# Altium schematic sheet DRIVER_LED&AFE.SchDoc
size B
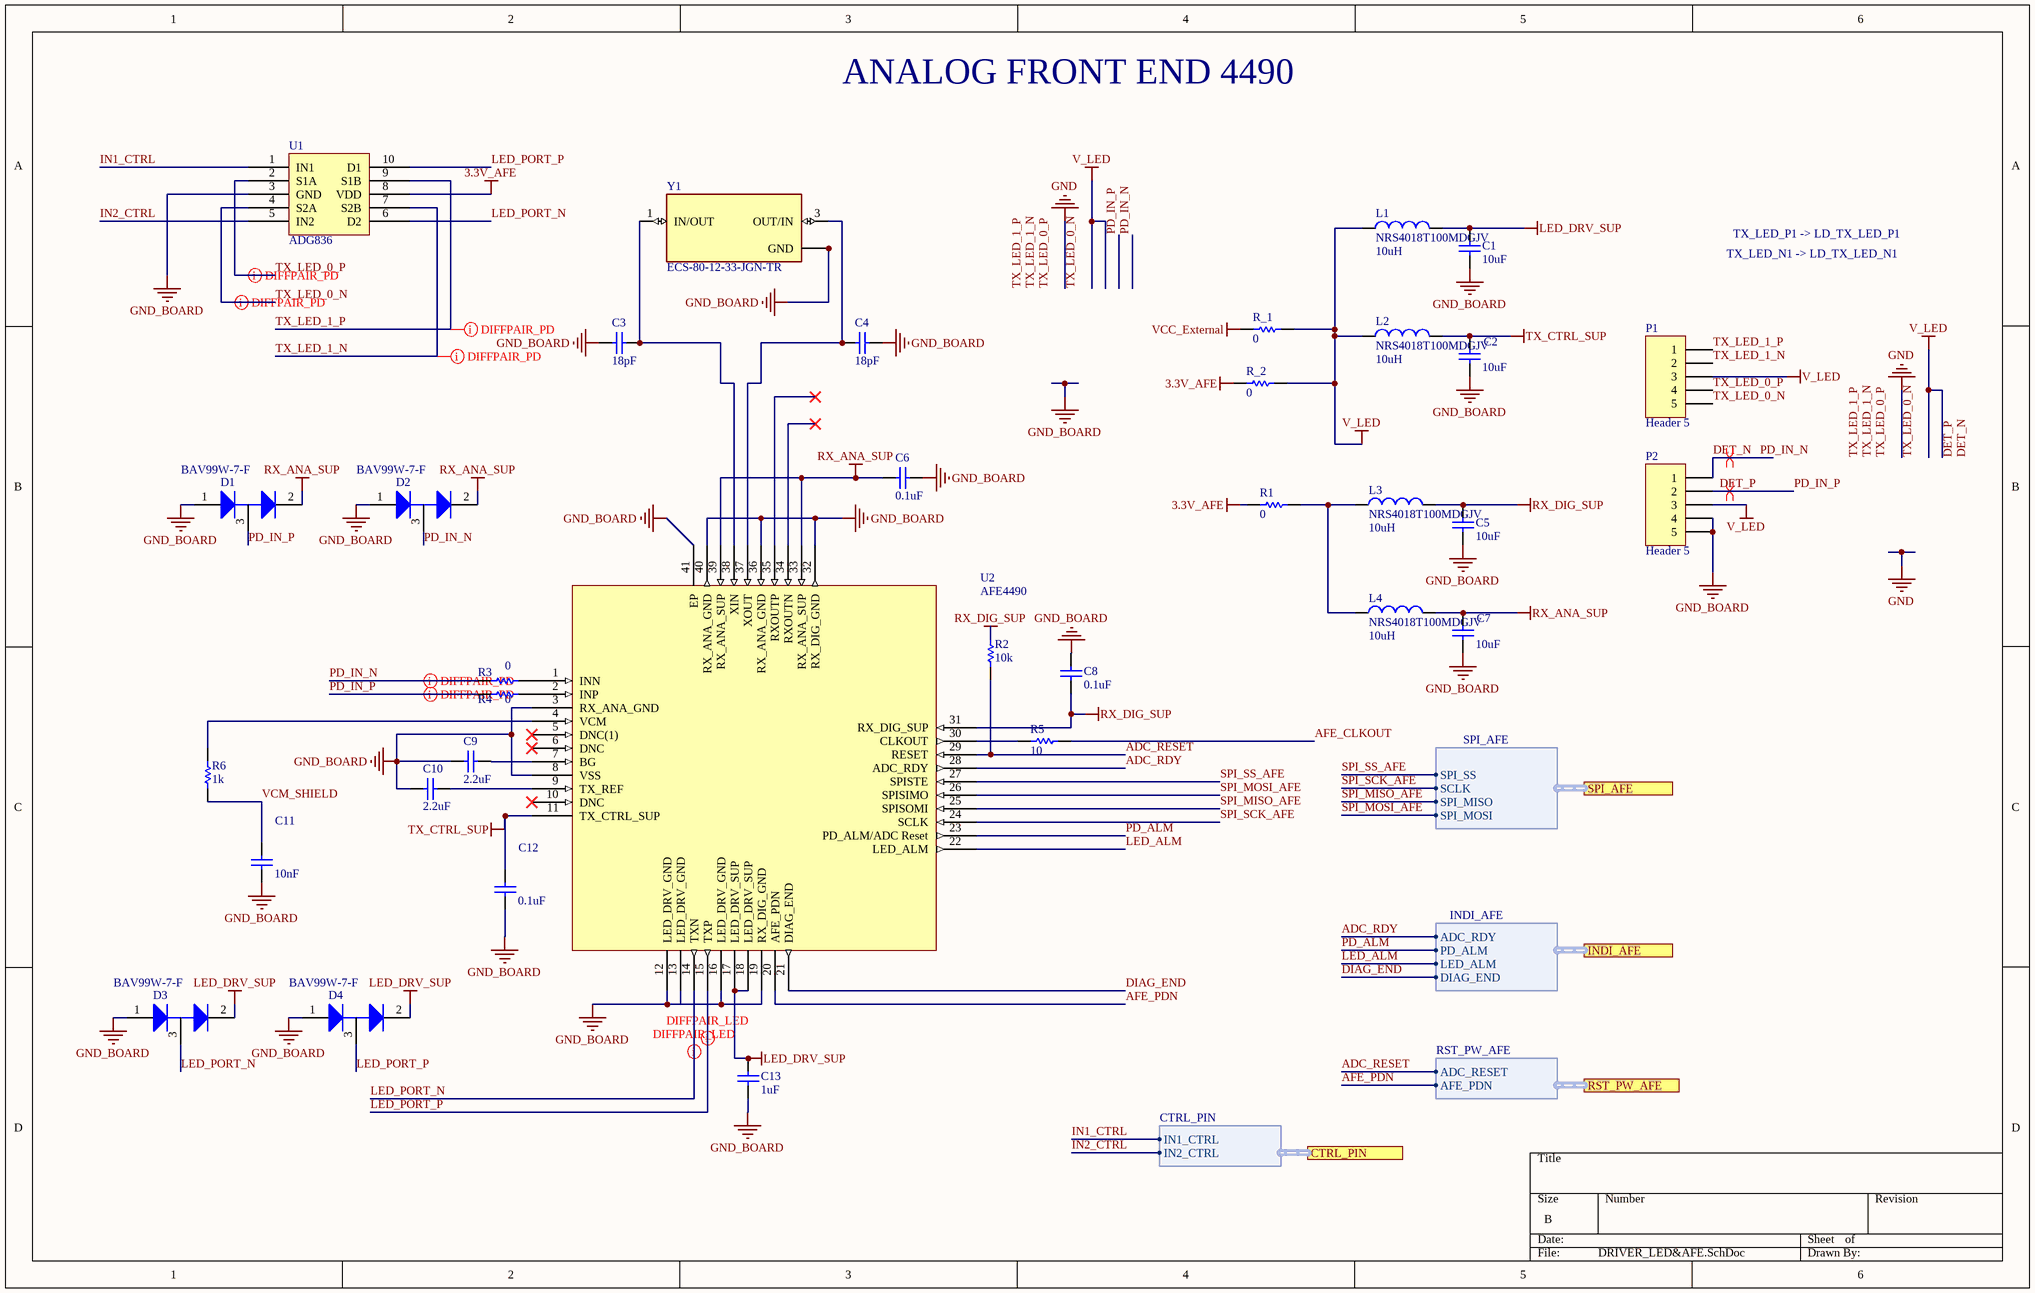
[diagram p0: DRIVER_LED&AFE.SchDoc]

## Parts
C1  value 10uF  [RES-SMD-0603]  (hidden comment: Cap)
C2  value 10uF  [RES-SMD-0603]  (hidden comment: Cap)
C3  value 18pF  [RES-SMD-0603]  (hidden comment: Cap)
C4  value 18pF  [RES-SMD-0603]  (hidden comment: Cap)
C5  value 10uF  [RES-SMD-0603]  (hidden comment: Cap)
C6  value 0.1uF  [RES-SMD-0603]  (hidden comment: Cap)
C7  value 10uF  [RES-SMD-0603]  (hidden comment: Cap)
C8  value 0.1uF  [RES-SMD-0603]  (hidden comment: Cap)
C9  value 2.2uF  [RES-SMD-0603]  (hidden comment: Cap)
C10  value 2.2uF  [RES-SMD-0603]  (hidden comment: Cap)
C11  value 10nF  [RES-SMD-0603]  (hidden comment: Cap)
C12  value 0.1uF  [RES-SMD-0603]  (hidden comment: Cap)
C13  value 1uF  [RES-SMD-0603]  (hidden comment: Cap)
D1  BAV99W-7-F  [SOT-323]
D2  BAV99W-7-F  [SOT-323]
D3  BAV99W-7-F  [SOT-323]
D4  BAV99W-7-F  [SOT-323]
L1  NRS4018T100MDGJV  value 10uH  [NRS4018]
L2  NRS4018T100MDGJV  value 10uH  [NRS4018]
L3  NRS4018T100MDGJV  value 10uH  [NRS4018]
L4  NRS4018T100MDGJV  value 10uH  [NRS4018]
P1  Header 5  [HDR1X5]
P2  Header 5  [HDR1X5]
R1  value 0  [RES-SMD-0603]  (hidden comment: Res1)
R2  value 10k  [RES-SMD-0603]  (hidden comment: Res1)
R3  value 0  [RES-SMD-0603]  (hidden comment: Res1)
R4  value 0  [RES-SMD-0603]  (hidden comment: Res1)
R5  value 10  [RES-SMD-0603]  (hidden comment: Res1)
R6  value 1k  [RES-SMD-0603]  (hidden comment: Res1)
R_1  value 0  [RES-SMD-0603]  (hidden comment: Res1)
R_2  value 0  [RES-SMD-0603]  (hidden comment: Res1)
U1  ADG836  [MSOP-10]
U2  AFE4490  [VQFN (40)]
Y1  ECS-80-12-33-JGN-TR  [XTAL_ECS-240-8-33-AGN-TR]

## Ports
CTRL_PIN (harness CTRL_PIN), INDI_AFE (harness INDI_AFE), RST_PW_AFE (harness RST_PW_AFE), SPI_AFE (harness SPI_AFE)

## Harnesses
SPI_AFE: SPI_SS, SCLK, SPI_MISO, SPI_MOSI
INDI_AFE: ADC_RDY, PD_ALM, LED_ALM, DIAG_END
RST_PW_AFE: ADC_RESET, AFE_PDN
CTRL_PIN: IN1_CTRL, IN2_CTRL

## Nets
3.3V_AFE: R1.1 R_2.1 U1.8(VDD)
GND_BOARD: C1.2 C2.1 C3.1 C4.2 C5.2 C6.2 C7.1 C8.1 C9.2 C10.2 C11.1 C12.1 C13.1 D1.1 D2.1 D3.1 D4.1 P2.4 P2.5 U1.3(GND) U2.3(RX_ANA_GND) U2.8(VSS) U2.12(LED_DRV_GND) U2.13(LED_DRV_GND) U2.16(LED_DRV_GND) U2.19(RX_DIG_GND) U2.32(RX_DIG_GND) U2.36(RX_ANA_GND) U2.40(RX_ANA_GND) U2.41(EP) Y1.2(GND) Y1.4(GND)
LED_DRV_SUP: C1.1 C13.2 D3.2 D4.2 L1.2 U2.17(LED_DRV_SUP) U2.18(LED_DRV_SUP)
RX_ANA_SUP: C6.1 C7.2 D1.2 D2.2 L4.2 U2.33(RX_ANA_SUP) U2.39(RX_ANA_SUP)
RX_DIG_SUP: C5.1 C8.2 L3.2 R2.1 U2.31(RX_DIG_SUP)
TX_CTRL_SUP: C2.2 C12.2 L2.2 U2.11(TX_CTRL_SUP)
V_LED: L1.1 L2.1 P1.3 P2.3 R_1.2 R_2.2
VCC_External: R_1.1
ADC_RDY: U2.28(ADC_RDY) ; port INDI_AFE.ADC_RDY
ADC_RESET: R2.2 U2.29(RESET) ; port RST_PW_AFE.ADC_RESET
AFE_CLKOUT: R5.1
AFE_PDN: U2.20(AFE_PDN) ; port RST_PW_AFE.AFE_PDN
DET_N: D2.3 P2.1 R3.1  [also labelled PD_IN_N]
DET_P: D1.3 P2.2 R4.1  [also labelled PD_IN_P]
DIAG_END: U2.21(DIAG_END) ; port INDI_AFE.DIAG_END
IN1_CTRL: U1.1(IN1) ; port CTRL_PIN.IN1_CTRL
IN2_CTRL: U1.5(IN2) ; port CTRL_PIN.IN2_CTRL
LED_ALM: U2.22(LED_ALM) ; port INDI_AFE.LED_ALM
LED_PORT_N: D3.3 U1.6(D2) U2.14(TXN)
LED_PORT_P: D4.3 U1.10(D1) U2.15(TXP)
PD_ALM: U2.23(PD_ALM/ADC_Reset) ; port INDI_AFE.PD_ALM
SPI_MISO_AFE: U2.25(SPISOMI) ; port SPI_AFE.SPI_MISO
SPI_MOSI_AFE: U2.26(SPISIMO) ; port SPI_AFE.SPI_MOSI
SPI_SCK_AFE: U2.24(SCLK) ; port SPI_AFE.SCLK
SPI_SS_AFE: U2.27(SPISTE) ; port SPI_AFE.SPI_SS
TX_LED_0_N: P1.5 U1.4(S2A)
TX_LED_0_P: P1.4 U1.2(S1A)
TX_LED_1_N: P1.2 U1.7(S2B)
TX_LED_1_P: P1.1 U1.9(S1B)
VCM_SHIELD: C11.2 R6.2
NetC3_2: C3.2 U2.38(XIN) Y1.1(IN/OUT)
NetC4_1: C4.1 U2.37(XOUT) Y1.3(OUT/IN)
NetC9_1: C9.1 U2.7(BG)
NetC10_1: C10.1 U2.9(TX_REF)
NetL3_1: L3.1 L4.1 R1.2
NetR3_2: R3.2 U2.1(INN)
NetR4_2: R4.2 U2.2(INP)
NetR5_2: R5.2 U2.30(CLKOUT)
NetR6_1: R6.1 U2.4(VCM)

Not connected (* = marked no-connect by the designer): U2 5(DNC(1))* 6(DNC)* 10(DNC)* 34(RXOUTN)* 35(RXOUTP)*

## Layout directives
differential pair: DET_N, DET_P, LED_PORT_N, LED_PORT_P, TX_LED_0_N, TX_LED_0_P, TX_LED_1_N, TX_LED_1_P

## Notes on the sheet
- ANALOG FRONT END 4490
- TX_LED_P1 -> LD_TX_LED_P1
- TX_LED_N1 -> LD_TX_LED_N1
- Labels drawn without touching a wire or pin: DET_N, DET_P, TX_LED_0_N, TX_LED_0_P, TX_LED_1_N, TX_LED_1_P

## Library data of the parts
C1-C13 = Cap: Capacitor; Published: 8-Jun-2000; LatestRevisionDate: 17-Jul-2002; LatestRevisionNote: Re-released for DXP Platform.; PackageReference: RAD-0.3; Publisher: Altium Limited; PackageDescription: Radial Cap, Thru-Hole; 2 Leads; 0.3 in Pin Spacing
L1-L4 = Inductor: Code_IEC: 1005; Published: 8-Jun-2000; LatestRevisionDate: 29-May-2009; LatestRevisionNote: IPC-7351 Footprint Added.; PackageReference: 0402-A; Publisher: Altium Limited; PackageDescription: Chip Inductor; Code_JEITA: 0402
P1 P2 = Header 5: Header, 5-Pin; LatestRevisionDate: 17-Jul-2002; LatestRevisionNote: Re-released for DXP Platform.; Publisher: Altium Limited
R1-R6 R_1 R_2 = Res1: Resistor; Published: 8-Jun-2000; LatestRevisionDate: 17-Jul-2002; LatestRevisionNote: Re-released for DXP Platform.; PackageReference: AXIAL-0.3; Publisher: Altium Limited; PackageDescription: Axial Device, Thru-Hole; 2 Leads; 0.3 in Pin Spacing
Y1 = ECS-80-12-33-JGN-TR: 8MHz Â±20ppm Crystal 12pF 400 Ohms 4-SMD, No Lead; MF: ECS Inc.; Package: SMD-4 ECS International; MP: ECS-80-12-33-JGN-TR; Value: *; Availability: Warning; Price: None; SnapEDA_Link: https://www.snapeda.com/parts/ECS-80-12-33-JGN-TR/ECS%20Inc./view-part/4477300/?ref=snap; Mouser-Purchase-URL: https://snapeda.com/shop?store=Mouser&id=4477300; BuyPart: https://www.snapeda.com/parts/ECS-80-12-33-JGN-TR/ECS%20Inc./view-part/4477300/?ref=eda